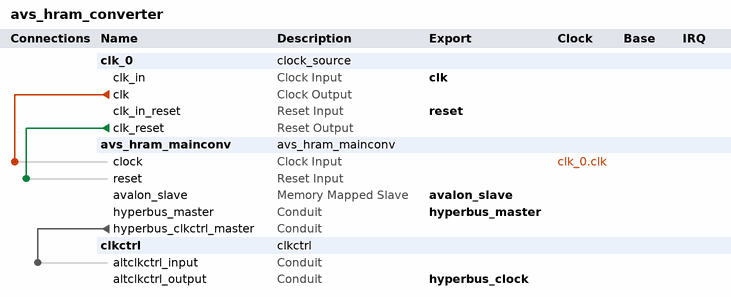
[diagram p0: system contents]
# Platform Designer (Qsys) system avs_hram_converter, Cyclone 10 LP 10CL006YE144A7G
# Parameters at their usual value, and those the tool derives, are not listed.
package require -exact qsys 22.1
create_system avs_hram_converter
set_project_property DEVICE_FAMILY {Cyclone 10 LP}
set_project_property DEVICE 10CL006YE144A7G

add_instance clk_0 clock_source 22.1
set_instance_parameter_value clk_0 clockFrequency 50000000

add_instance avs_hram_mainconv avs_hram_mainconv 1.0
set_instance_parameter_value avs_hram_mainconv drive_strength 0

add_instance clkctrl clkctrl 1.0

# connections
add_connection clk_0.clk avs_hram_mainconv.clock clock
add_connection clk_0.clk_reset avs_hram_mainconv.reset reset
add_connection avs_hram_mainconv.hyperbus_clkctrl_master clkctrl.altclkctrl_input conduit

# exported interfaces
add_interface avalon_slave avalon slave
set_interface_property avalon_slave EXPORT_OF avs_hram_mainconv.avalon_slave
add_interface clk clock sink
set_interface_property clk EXPORT_OF clk_0.clk_in
add_interface hyperbus_clock conduit end
set_interface_property hyperbus_clock EXPORT_OF clkctrl.altclkctrl_output
add_interface hyperbus_master conduit end
set_interface_property hyperbus_master EXPORT_OF avs_hram_mainconv.hyperbus_master
add_interface reset reset sink
set_interface_property reset EXPORT_OF clk_0.clk_in_reset

set_interconnect_requirement {$system} qsys_mm.clockCrossingAdapter HANDSHAKE
set_interconnect_requirement {$system} qsys_mm.enableEccProtection FALSE
set_interconnect_requirement {$system} qsys_mm.insertDefaultSlave FALSE
set_interconnect_requirement {$system} qsys_mm.maxAdditionalLatency 1

save_system avs_hram_converter.qsys
